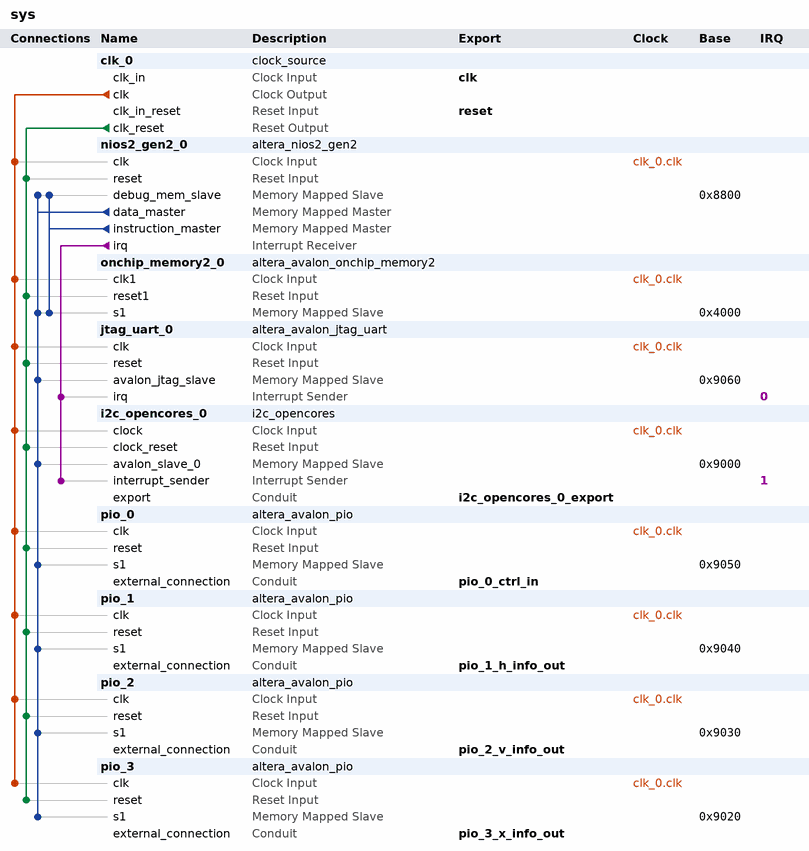
[diagram p0: system contents]
# Platform Designer (Qsys) system sys, Cyclone 10 LP 10CL025YE144C8G
# Parameters at their usual value, and those the tool derives, are not listed.
package require -exact qsys 19.1
create_system sys
set_project_property DEVICE_FAMILY {Cyclone 10 LP}
set_project_property DEVICE 10CL025YE144C8G

add_instance clk_0 clock_source 19.1
set_instance_parameter_value clk_0 clockFrequency 25000000

add_instance nios2_gen2_0 altera_nios2_gen2 19.1
set_instance_parameter_value nios2_gen2_0 dcache_size 2048
set_instance_parameter_value nios2_gen2_0 exceptionSlave onchip_memory2_0.s1
set_instance_parameter_value nios2_gen2_0 icache_size 4096
set_instance_parameter_value nios2_gen2_0 impl Tiny
set_instance_parameter_value nios2_gen2_0 resetSlave onchip_memory2_0.s1

add_instance onchip_memory2_0 altera_avalon_onchip_memory2 19.1
set_instance_parameter_value onchip_memory2_0 dataWidth 32
set_instance_parameter_value onchip_memory2_0 dualPort false
set_instance_parameter_value onchip_memory2_0 initMemContent true
set_instance_parameter_value onchip_memory2_0 initializationFileName onchip_mem.hex
set_instance_parameter_value onchip_memory2_0 memorySize 16384

add_instance jtag_uart_0 altera_avalon_jtag_uart 19.1
set_instance_parameter_value jtag_uart_0 readBufferDepth 32
set_instance_parameter_value jtag_uart_0 simInteractiveOptions NO_INTERACTIVE_WINDOWS
set_instance_parameter_value jtag_uart_0 useRegistersForReadBuffer true
set_instance_parameter_value jtag_uart_0 useRegistersForWriteBuffer true
set_instance_parameter_value jtag_uart_0 writeBufferDepth 32

add_instance i2c_opencores_0 i2c_opencores 17.1

add_instance pio_0 altera_avalon_pio 19.1
set_instance_parameter_value pio_0 direction Input
set_instance_parameter_value pio_0 width 32

add_instance pio_1 altera_avalon_pio 19.1
set_instance_parameter_value pio_1 direction Output
set_instance_parameter_value pio_1 width 32

add_instance pio_2 altera_avalon_pio 19.1
set_instance_parameter_value pio_2 direction Output
set_instance_parameter_value pio_2 width 32

add_instance pio_3 altera_avalon_pio 19.1
set_instance_parameter_value pio_3 direction Output
set_instance_parameter_value pio_3 width 32

# connections
add_connection clk_0.clk i2c_opencores_0.clock clock
add_connection clk_0.clk jtag_uart_0.clk clock
add_connection clk_0.clk nios2_gen2_0.clk clock
add_connection clk_0.clk onchip_memory2_0.clk1 clock
add_connection clk_0.clk pio_0.clk clock
add_connection clk_0.clk pio_1.clk clock
add_connection clk_0.clk pio_2.clk clock
add_connection clk_0.clk pio_3.clk clock
add_connection clk_0.clk_reset i2c_opencores_0.clock_reset reset
add_connection clk_0.clk_reset jtag_uart_0.reset reset
add_connection clk_0.clk_reset nios2_gen2_0.reset reset
add_connection clk_0.clk_reset onchip_memory2_0.reset1 reset
add_connection clk_0.clk_reset pio_0.reset reset
add_connection clk_0.clk_reset pio_1.reset reset
add_connection clk_0.clk_reset pio_2.reset reset
add_connection clk_0.clk_reset pio_3.reset reset
add_connection nios2_gen2_0.data_master i2c_opencores_0.avalon_slave_0 avalon
set_connection_parameter_value nios2_gen2_0.data_master/i2c_opencores_0.avalon_slave_0 baseAddress 0x9000
add_connection nios2_gen2_0.data_master jtag_uart_0.avalon_jtag_slave avalon
set_connection_parameter_value nios2_gen2_0.data_master/jtag_uart_0.avalon_jtag_slave baseAddress 0x9060
add_connection nios2_gen2_0.data_master nios2_gen2_0.debug_mem_slave avalon
set_connection_parameter_value nios2_gen2_0.data_master/nios2_gen2_0.debug_mem_slave baseAddress 0x8800
add_connection nios2_gen2_0.data_master onchip_memory2_0.s1 avalon
set_connection_parameter_value nios2_gen2_0.data_master/onchip_memory2_0.s1 baseAddress 0x4000
add_connection nios2_gen2_0.data_master pio_0.s1 avalon
set_connection_parameter_value nios2_gen2_0.data_master/pio_0.s1 baseAddress 0x9050
add_connection nios2_gen2_0.data_master pio_1.s1 avalon
set_connection_parameter_value nios2_gen2_0.data_master/pio_1.s1 baseAddress 0x9040
add_connection nios2_gen2_0.data_master pio_2.s1 avalon
set_connection_parameter_value nios2_gen2_0.data_master/pio_2.s1 baseAddress 0x9030
add_connection nios2_gen2_0.data_master pio_3.s1 avalon
set_connection_parameter_value nios2_gen2_0.data_master/pio_3.s1 baseAddress 0x9020
add_connection nios2_gen2_0.instruction_master nios2_gen2_0.debug_mem_slave avalon
set_connection_parameter_value nios2_gen2_0.instruction_master/nios2_gen2_0.debug_mem_slave baseAddress 0x8800
add_connection nios2_gen2_0.instruction_master onchip_memory2_0.s1 avalon
set_connection_parameter_value nios2_gen2_0.instruction_master/onchip_memory2_0.s1 baseAddress 0x4000
add_connection nios2_gen2_0.irq i2c_opencores_0.interrupt_sender interrupt
set_connection_parameter_value nios2_gen2_0.irq/i2c_opencores_0.interrupt_sender irqNumber 1
add_connection nios2_gen2_0.irq jtag_uart_0.irq interrupt
set_connection_parameter_value nios2_gen2_0.irq/jtag_uart_0.irq irqNumber 0

# exported interfaces
add_interface clk clock sink
set_interface_property clk EXPORT_OF clk_0.clk_in
add_interface i2c_opencores_0_export conduit end
set_interface_property i2c_opencores_0_export EXPORT_OF i2c_opencores_0.export
add_interface pio_0_ctrl_in conduit end
set_interface_property pio_0_ctrl_in EXPORT_OF pio_0.external_connection
add_interface pio_1_h_info_out conduit end
set_interface_property pio_1_h_info_out EXPORT_OF pio_1.external_connection
add_interface pio_2_v_info_out conduit end
set_interface_property pio_2_v_info_out EXPORT_OF pio_2.external_connection
add_interface pio_3_x_info_out conduit end
set_interface_property pio_3_x_info_out EXPORT_OF pio_3.external_connection
add_interface reset reset sink
set_interface_property reset EXPORT_OF clk_0.clk_in_reset

set_interconnect_requirement {$system} qsys_mm.clockCrossingAdapter HANDSHAKE
set_interconnect_requirement {$system} qsys_mm.enableEccProtection FALSE
set_interconnect_requirement {$system} qsys_mm.insertDefaultSlave FALSE
set_interconnect_requirement {$system} qsys_mm.maxAdditionalLatency 1

save_system sys.qsys
